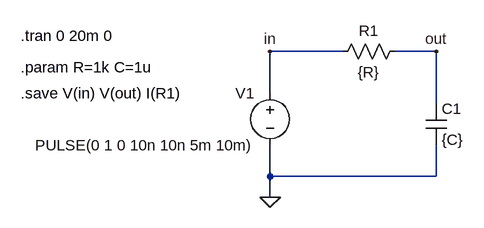
[diagram p0: schematic low_pass_filter.asc]
low_pass_filter.asc, the LTspice schematic file:
Version 4
SHEET 1 880 680
WIRE 176 48 64 48
WIRE 320 48 256 48
WIRE 64 112 64 48
WIRE 320 128 320 48
WIRE 64 240 64 192
WIRE 320 240 320 192
WIRE 320 240 64 240
WIRE 64 272 64 240
FLAG 64 272 0
FLAG 64 48 in
FLAG 320 48 out
SYMBOL voltage 64 96 M0
WINDOW 123 0 0 Left 0
WINDOW 39 0 0 Left 0
SYMATTR InstName V1
SYMATTR Value PULSE(0 1 0 10n 10n 5m 10m)
SYMBOL res 272 32 R90
WINDOW 0 0 56 VBottom 2
WINDOW 3 32 56 VTop 2
SYMATTR InstName R1
SYMATTR Value {R}
SYMBOL cap 304 128 R0
SYMATTR InstName C1
SYMATTR Value {C}
TEXT -320 24 Left 2 !.tran 0 20m 0
TEXT -320 72 Left 2 !.param R=1k C=1u
TEXT -320 112 Left 2 !.save V(in) V(out) I(R1)

The netlist it stands for:
* low_pass_filter.asc
V1 in 0 PULSE(0 1 0 10n 10n 5m 10m)
R1 out in {R}
C1 out 0 {C}
.tran 0 20m 0
.param R=1k C=1u
.save V(in) V(out) I(R1)
.backanno
.end